# Altium schematic sheet Connectors.SchDoc
size A4; SheetNumber: 4; SheetTotal: 4
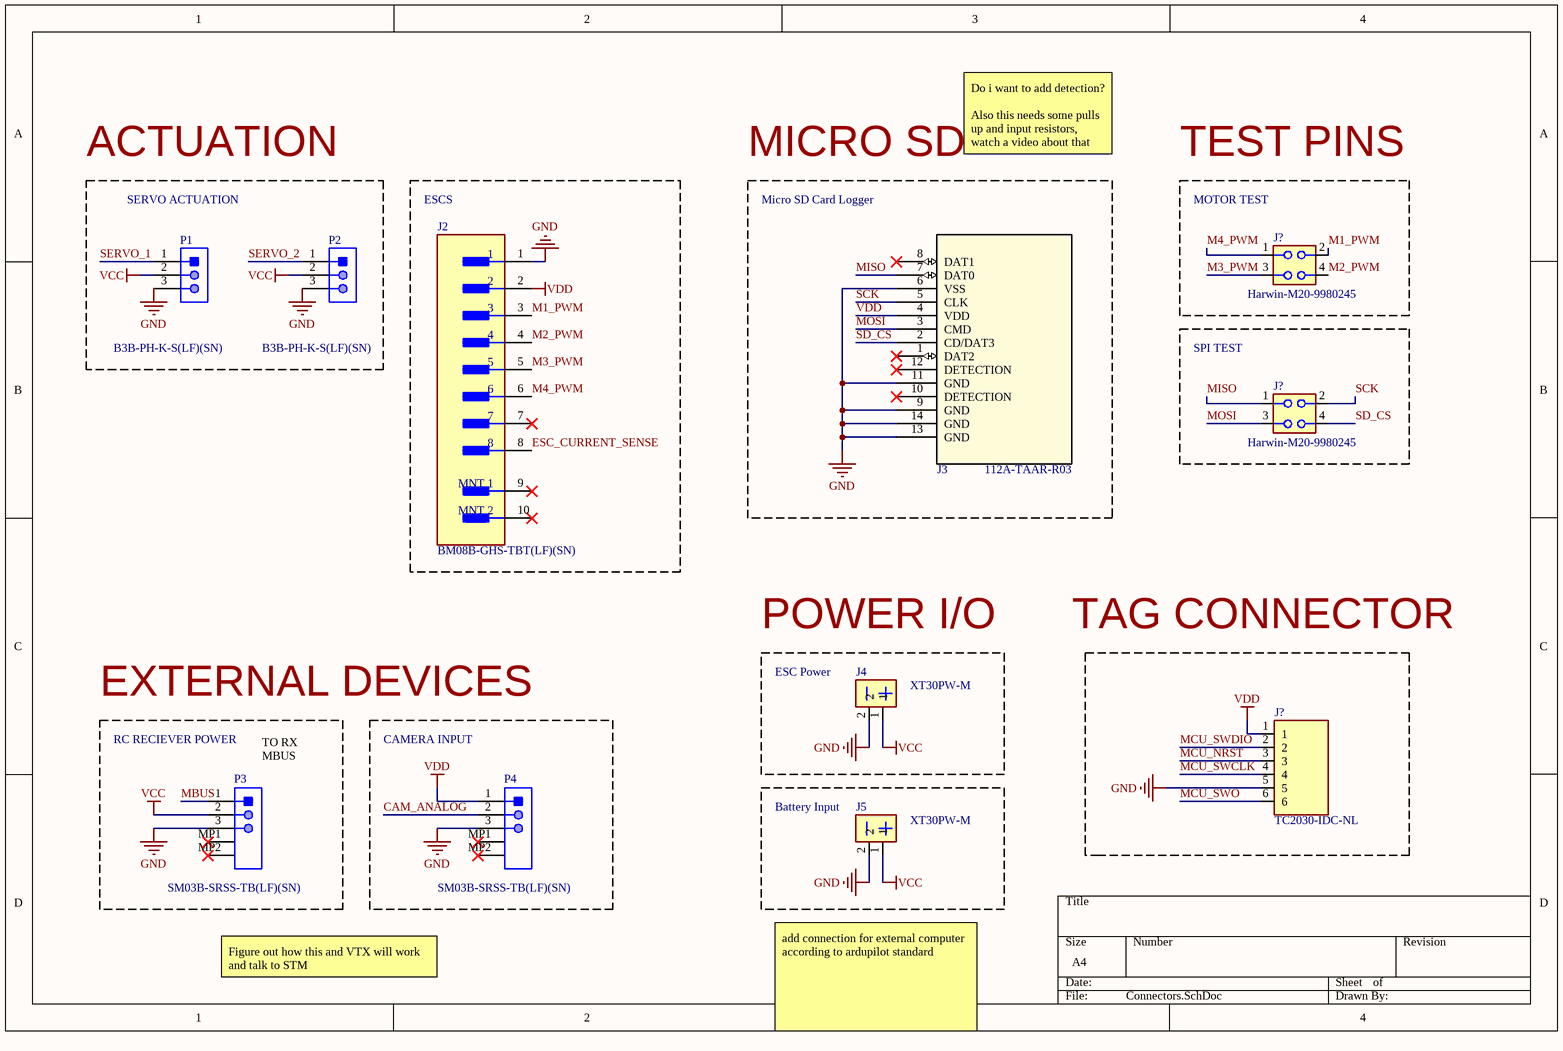
[diagram p0: Connectors.SchDoc]

## Parts
(Parts that share a designator on the sheet are numbered #1, #2 ... from top to bottom, then left to right.)
J2  BM08B-GHS-TBT(LF)(SN)  [FP-BM08B-GHS-TBT_LF_SN-MFG]
J3  112A-TAAR-R03  [CONN8_-TAAR-R03_ATT]
J4  XT30PW-M  [AMASS_XT30PW-M]
J5  XT30PW-M  [AMASS_XT30PW-M]
J?#1  Harwin-M20-9980245  [HARWIN_M20-9980245]
J?#2  Harwin-M20-9980245  [HARWIN_M20-9980245]
J?#3  TC2030-IDC-NL  [TAG_TC2030-IDC-NL]
P1  B3B-PH-K-S(LF)(SN)  [JST-B3B-PH-K-S-3_V]
P2  B3B-PH-K-S(LF)(SN)  [JST-B3B-PH-K-S-3_V]
P3  SM03B-SRSS-TB(LF)(SN)  [JST-SM03B-SRSS-TB_V]
P4  SM03B-SRSS-TB(LF)(SN)  [JST-SM03B-SRSS-TB_V]

## Blocks framed on the sheet
ACTUATION: P1 P2
ESCS: J2
MICRO SD: J3
TEST PINS: J?#1
SPI TEST: J?#2
POWER I/O: J4
EXTERNAL DEVICES: P3
CAMERA INPUT: P4
Battery Input: J5

## Nets
GND: J2.1 J3.6(VSS) J3.9(GND) J3.11(GND) J3.13(GND) J3.14(GND) J4.2 J5.2 J?#3.5 P1.3 P2.3 P3.3 P4.3
VCC: J4.1 J5.1 P1.2 P2.2 P3.2
VDD: J2.2 J3.4(VDD) J?#3.1 P4.1
CAM_ANALOG: P4.2
ESC_CURRENT_SENSE: J2.8
M1_PWM: J2.3 J?#1.2
M2_PWM: J2.4 J?#1.4
M3_PWM: J2.5 J?#1.3
M4_PWM: J2.6 J?#1.1
MBUS: P3.1
MCU_NRST: J?#3.3
MCU_SWCLK: J?#3.4
MCU_SWDIO: J?#3.2
MCU_SWO: J?#3.6
MISO: J3.7(DAT0) J?#2.1
MOSI: J3.3(CMD) J?#2.3
SCK: J3.5(CLK) J?#2.2
SD_CS: J3.2(CD/DAT3) J?#2.4
SERVO_1: P1.1
SERVO_2: P2.1

Not connected (* = marked no-connect by the designer): J2 7* 9(MNT_1)* 10(MNT_2)*; J3 1(DAT2)* 8(DAT1)* 10(DETECTION)* 12(DETECTION)*; P3 MP1* MP2*; P4 MP1* MP2*

## Notes on the sheet
- Do i want to add detection?
  Also this needs some pulls up and input resistors, watch a video about that
- SERVO ACTUATION
- Micro SD Card Logger
- (near J?#1) MOTOR TEST
- TAG CONNECTOR
- (near J4) ESC Power
- RC RECIEVER POWER
- (near P3) TO RX MBUS
- Figure out how this and VTX will work and talk to STM
- add connection for external computer according to ardupilot standard

## Library data of the parts
J2 = CMP-17439-000100-2: CONN HEADER SMD 8POS 1.25MM; NexarPartId: 289283; Current Rating: 1A; Voltage Rating (AC): 50V; Number of Positions: 8; Wire/Cable Gauge: 26AWG; Contact Plating: Tin; Min Operating Temperature: -25°C; Contact Material: Copper, Tin; Packaging: Cut Tape; Max Operating Temperature: 85°C; Pitch: 1.25mm; Termination: SMD/SMT; REACH SVHC: No SVHC; Lead Free: Lead Free; Housing Material: Nylon; Height: 4.2mm; Case/Package: SMD/SMT; Lead Pitch: 1.25mm; Housing Color: Natural; Voltage Rating: 50V; RoHS: Compliant; Orientation: Straight; Number of Rows: 1; Number of Contacts: 8
J3 = CMP-255-000000-1: Manufacturer_Name: Attend; Copyright: Copyright (C) 2025 Ultra Librarian. All rights reserved.; Type: Type; Design Item ID: 112A-TAAR-R03; Source: 112A-TAAR-R03.SchLib; Manufacturer_Part_Number: 112A-TAAR-R03; RefDes: RefDes
J4 J5 = CMP-00055-6: Power Connector; MF: amass; MP: XT30UPB-M; Source: XT30UPB-M.SchLib; Value: *; Design Item ID: XT30UPB-M; Pin Count: 2; JLCPCB Part No.: C428721; Availability: Not in stock; Check_prices: https://www.snapeda.com/parts/XT30UPB-M/AMASS/view-part/?ref=eda; SnapEDA_Link: https://www.snapeda.com/parts/XT30UPB-M/AMASS/view-part/?ref=snap; Package: None; Price: None; Component Type: Standard
J?#1 J?#2 = CMP-031-000001-6: Connector Header Through Hole 4 position 0.100" (2.54mm); MIL Conformance: No; Connector Type: BOARD CONNECTOR; Option: General Purpose; Number of Contacts: 4; Number of Rows Loaded: 1; Source: M20-9980245.SchLib; JLCPCB Part No.: C6585845; DIN Conformance: No; IEC Conformance: No; Mounting Technology: Board; JESD-609 Code: e4; Contact Finish - Termination: Gold (Au); Component Type: Standard; Pin Count: 4; Price: None; Mounting Style: STRAIGHT; Contact Material: Brass; Termination: Solder; Contact Finish - Mating: GOLD; Contact Gender: Male; Design Item ID: M20-9980245; Availability: Unavailable; Filter Feature: No; Terminal Pitch: 2.54mm; Value: *; Flammability Rating: UL94 V-0; MP: M20-9980245; Package: None; RoHS Compliant: Yes; Reach SVHC Compliant: Yes; Mixed Contacts: No
J?#3 = CMP-257-000000-1: CABLE ADAPTER 6 POS; Availability: Unavailable; Price: None; Design Item ID: TC2030-IDC-NL; Source: TC2030-IDC-NL.SchLib; Component Type: Standard; Value: *; Package: None; MP: TC2030-IDC-NL; Pin Count: 6
P1 P2 = CMP-2000-05164-1: Male Header, Pitch 2 mm, 1 x 3 Position, Height 6 mm, Tail Length 3.4 mm, -25 to 85 degC, RoHS, Bulk; Manufacturer: JST; Style/Orientation: StraightHeader/Plug; Pitch: 2mm; No of Positions: 3; Termination: Crimp; Manufacturer URL: http://www.jst.com/home2.html; Datasheet Version: Oct-06; Type: ShroudedHeader; Datasheet URL: https://datasheet.ciiva.com/11746/0900766b80826550-11746939.pdf
P3 P4 = CMP-2000-07077-1: Male Header, Pitch 1 mm, 1 x 3 Position, Height 2.9 mm, -25 to 85 degC, RoHS, Tape and Reel; Manufacturer: JST; Pitch: 1mm; Style/Orientation: RightAngleHeader/Plug; No of Positions: 3; Package Description: Male Header, Pitch 1 mm, 1 x 3 Position, Height 2.9 mm; Manufacturer URL: http://www.jst.com/home2.html; Package Reference: SM03B-SRSS-TB; Type: ShroudedHeader; Termination: Crimp; Mounting Technology: SurfaceMount; Datasheet Version: 11/2010; Datasheet URL: https://datasheet.ciiva.com/26894/getdatasheetpartid-708885-26894671.pdf